# EAGLE schematic typeatron (EAGLE 6.5.0)
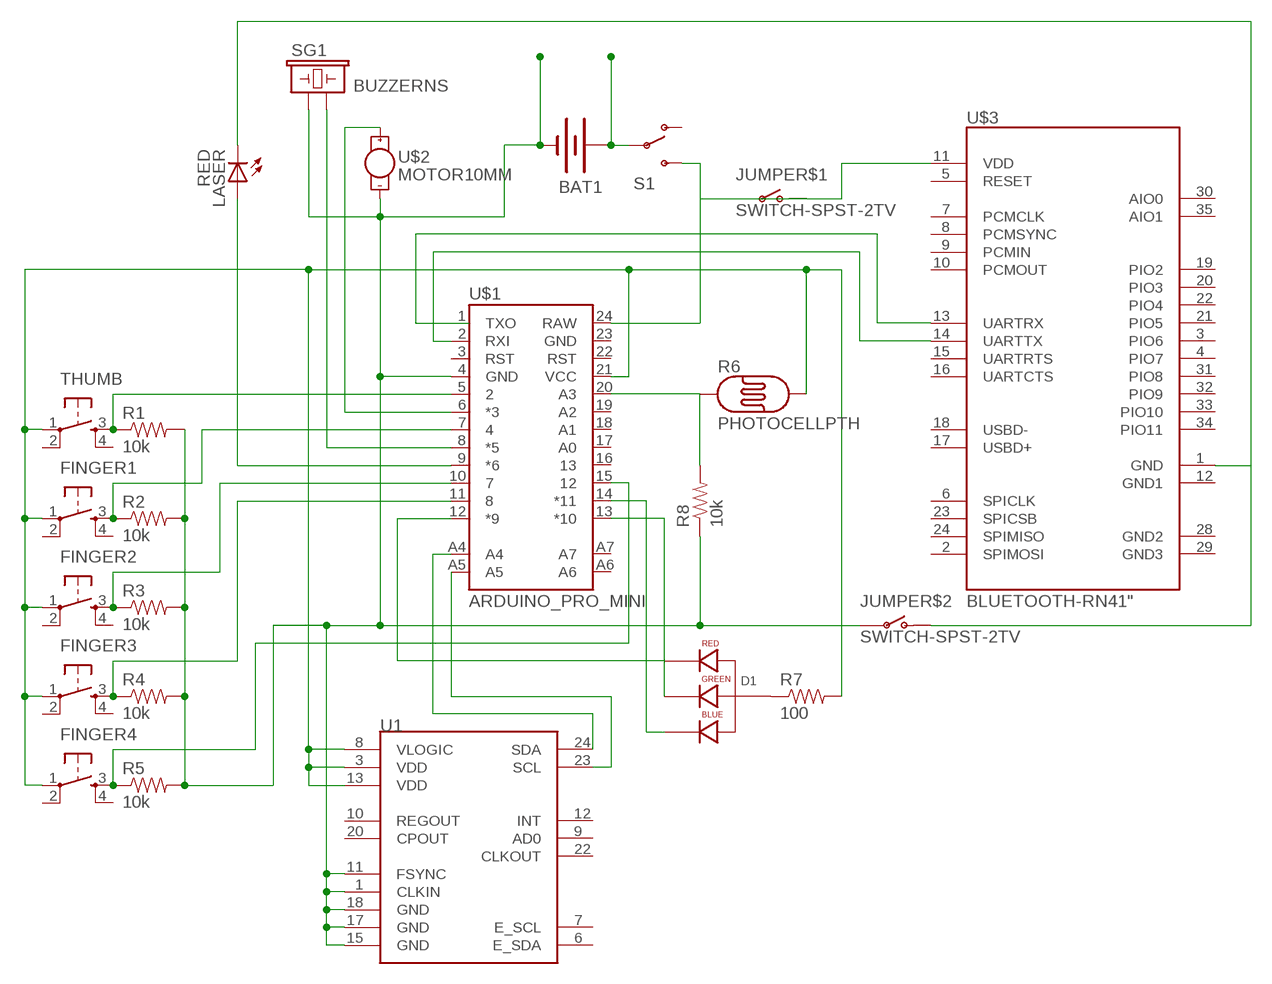
[diagram p0: schematic, sheet 1]

## Parts
BAT1  BATTERY1100  [LIPO-1100MAH]
D1  LED-RGB-CA-THRUDIFFUSE  [LED-RGB-THRU]
FINGER1  TAC_SWITCHPTH  [TACTILE-PTH]
FINGER2  TAC_SWITCHPTH  [TACTILE-PTH]
FINGER3  TAC_SWITCHPTH  [TACTILE-PTH]
FINGER4  TAC_SWITCHPTH  [TACTILE-PTH]
JUMPER$1  SWITCH-SPST-2TV  [SWITCH-SPST-VERTICAL]
JUMPER$2  SWITCH-SPST-2TV  [SWITCH-SPST-VERTICAL]
LASER  RED  LED-RED0603  [LED-0603]
R1  10k  10KOHM1/6W5%(PTH)KIT  [AXIAL-0.3-KIT]
R2  10k  10KOHM1/6W5%(PTH)KIT  [AXIAL-0.3-KIT]
R3  10k  10KOHM1/6W5%(PTH)KIT  [AXIAL-0.3-KIT]
R4  10k  10KOHM1/6W5%(PTH)KIT  [AXIAL-0.3-KIT]
R5  10k  10KOHM1/6W5%(PTH)KIT  [AXIAL-0.3-KIT]
R6  PHOTOCELLPTH  [PHOTOCELL]
R7  100  100OHM1/10W1%(0603)  [0603-RES]
R8  10k  10KOHM1/6W5%(PTH)KIT  [AXIAL-0.3-KIT]
S1  SWITCH-SPDTSMD2  [SWITCH-SPDT-SMD]
SG1  BUZZERNS  [BUZZER-12MM-NS]
THUMB  TAC_SWITCHPTH  [TACTILE-PTH]
U1  MPU-9150QFN-24-NP  [QFN-24-NP]
U$1  ARDUINO_PRO_MINI  [ARDUINO_PRO_MINI]
U$2  MOTOR10MM  [VIBE-MOTOR-10MM]
U$3  BLUETOOTH-RN41"  [RN41]

## Nets
N$1: FINGER1.3 R2.P$1 U$1.7
N$2: R1.P$1 THUMB.3 U$1.5
N$3: BAT1.- JUMPER$2.2(P) R1.P$2 R2.P$2 R3.P$2 R4.P$2 R5.P$2 R8.P$1 SG1.+ U1.1(CLKIN) U1.11(FSYNC) U1.15(GND) U1.17(GND) U1.18(GND) U$1.4(GND) U$2.-
N$4: FINGER2.3 R3.P$1 U$1.10
N$5: FINGER3.3 R4.P$1 U$1.11
N$6: FINGER4.3 R5.P$1 U$1.15
N$7: FINGER1.1 FINGER2.1 FINGER3.1 FINGER4.1 THUMB.1
N$8: R6.1 R8.P$2 U$1.20(A3)
N$9: JUMPER$2.1(O) LASER.C U$3.1(GND)
N$10: JUMPER$1.1(O) JUMPER$1.2(P) S1.3(S) U$1.24(RAW) U$3.11(VDD)
N$11: D1.2(ANODE) R7.1
N$12: D1.1(RED_CATHODE) U$1.12(*9)
N$13: D1.3(GREEN_CATHODE) U$1.13(*10)
N$14: D1.4(BLUE_CATHODE) U$1.14(*11)
N$15: U$1.6(*3) U$2.+
N$16: U1.23(SCL) U$1.A5
N$17: U1.24(SDA) U$1.A4
N$18: LASER.A
N$19: U$1.9(*6)
N$20: R6.2 R7.2 U1.3(VDD) U1.8(VLOGIC) U1.13(VDD) U$1.21(VCC)
N$21: U$1.2(RXI) U$3.14(UARTTX)
N$22: U$3.13(UARTRX)
N$23: SG1.- U$1.8(*5)
N$24: BAT1.+ S1.2(P)
Unconnected: FINGER1.2 FINGER1.4 FINGER2.2 FINGER2.4 FINGER3.2 FINGER3.4 FINGER4.2 FINGER4.4 S1.1(O) THUMB.2 THUMB.4 U1.6(E_SDA) U1.7(E_SCL) U1.9(AD0) U1.10(REGOUT) U1.12(INT) U1.20(CPOUT) U1.22(CLKOUT) U$1.1(TXO) U$1.3(RST) U$1.16 U$1.17(A0) U$1.18(A1) U$1.19(A2) U$1.22(RST) U$1.23(GND) U$1.A6 U$1.A7 U$3.2(SPIMOSI) U$3.3(PIO6) U$3.4(PIO7) U$3.5(RESET) U$3.6(SPICLK) U$3.7(PCMCLK) U$3.8(PCMSYNC) U$3.9(PCMIN) U$3.10(PCMOUT) U$3.12(GND1) U$3.15(UARTRTS) U$3.16(UARTCTS) U$3.17(USBD+) U$3.18(USBD-) U$3.19(PIO2) U$3.20(PIO3) U$3.21(PIO5) U$3.22(PIO4) U$3.23(SPICSB) U$3.24(SPIMISO) U$3.28(GND2) U$3.29(GND3) U$3.30(AIO0) U$3.31(PIO8) U$3.32(PIO9) U$3.33(PIO10) U$3.34(PIO11) U$3.35(AIO1)

## Library data of the parts
BAT1 = SparkFun-Electromechanical:BATTERY: Battery Holders Various common sizes : AA, AAA, 20mm coin cell and 12mm coin cell. 20MM_4LEGS, BATT-10373
D1 = SparkFun-LED:LED-RGB-CA-THRU: RGB Through-hole common anode SparkFun store front COM-10821 (diffuse) COM-10820 (clear); PROD_ID: DIO-10632
FINGER1-FINGER4 THUMB = SparkFun-Electromechanical:TAC_SWITCH: Momentary Switch Button commonly used for reset or general input. Spark Fun Electronics SKU : COM-00097 SMT- SWCH-08247
JUMPER$1 JUMPER$2 = SparkFun-Electromechanical:SWITCH-SPST-2
LASER = SparkFun-LED:LED-RED: Assorted Red LEDs LilyPad 1206- DIO-09912 1206- DIO-00809 0603- DIO-00819; PROD_ID: DIO-00819
R1-R5 R8 = SparkFun-Resistors:10KOHM1/6W5%(PTH): RES-08375; PROD_ID: RES-08375
R6 = SparkFun-Sensors:PHOTOCELL: CdS photoresistor. This is a low cost way to detect light levels. Resistance decreases with more incoming light. SparkFun SKU: SEN-09088
R7 = SparkFun-Resistors:100OHM1/10W1%(0603): RES-07863; PROD_ID: RES-07863
S1 = SparkFun-Electromechanical:SWITCH-SPDT: SPDT Switch Simple slide switch, Spark Fun Electronics SKU : COM-00102 DPDT SMT slide switch, AYZ0202, SWCH-08179
SG1 = SparkFun-Electromechanical:BUZZER: Buzzer 12mm Spark Fun Electronics SKU : Comp-Buzzer
U1 = SparkFun-Sensors:MPU-9150: 9DOF (3mag, 3accel, 3rotat). I2C interface.
U$1 = SparkFun-Boards:ARDUINO_PRO_MINI
U$2 = SparkFun-Electromechanical:MOTOR: Vibration Motor- ROB-08449 Physical dimension and wire connections for this powerful vibration motor. Motor has a self adhesive backing.
U$3 = SparkFun-RF:BLUETOOTH-RN41: Bluetooth SMD module